# EAGLE design Arduino_plate (EAGLE 7.4.0)
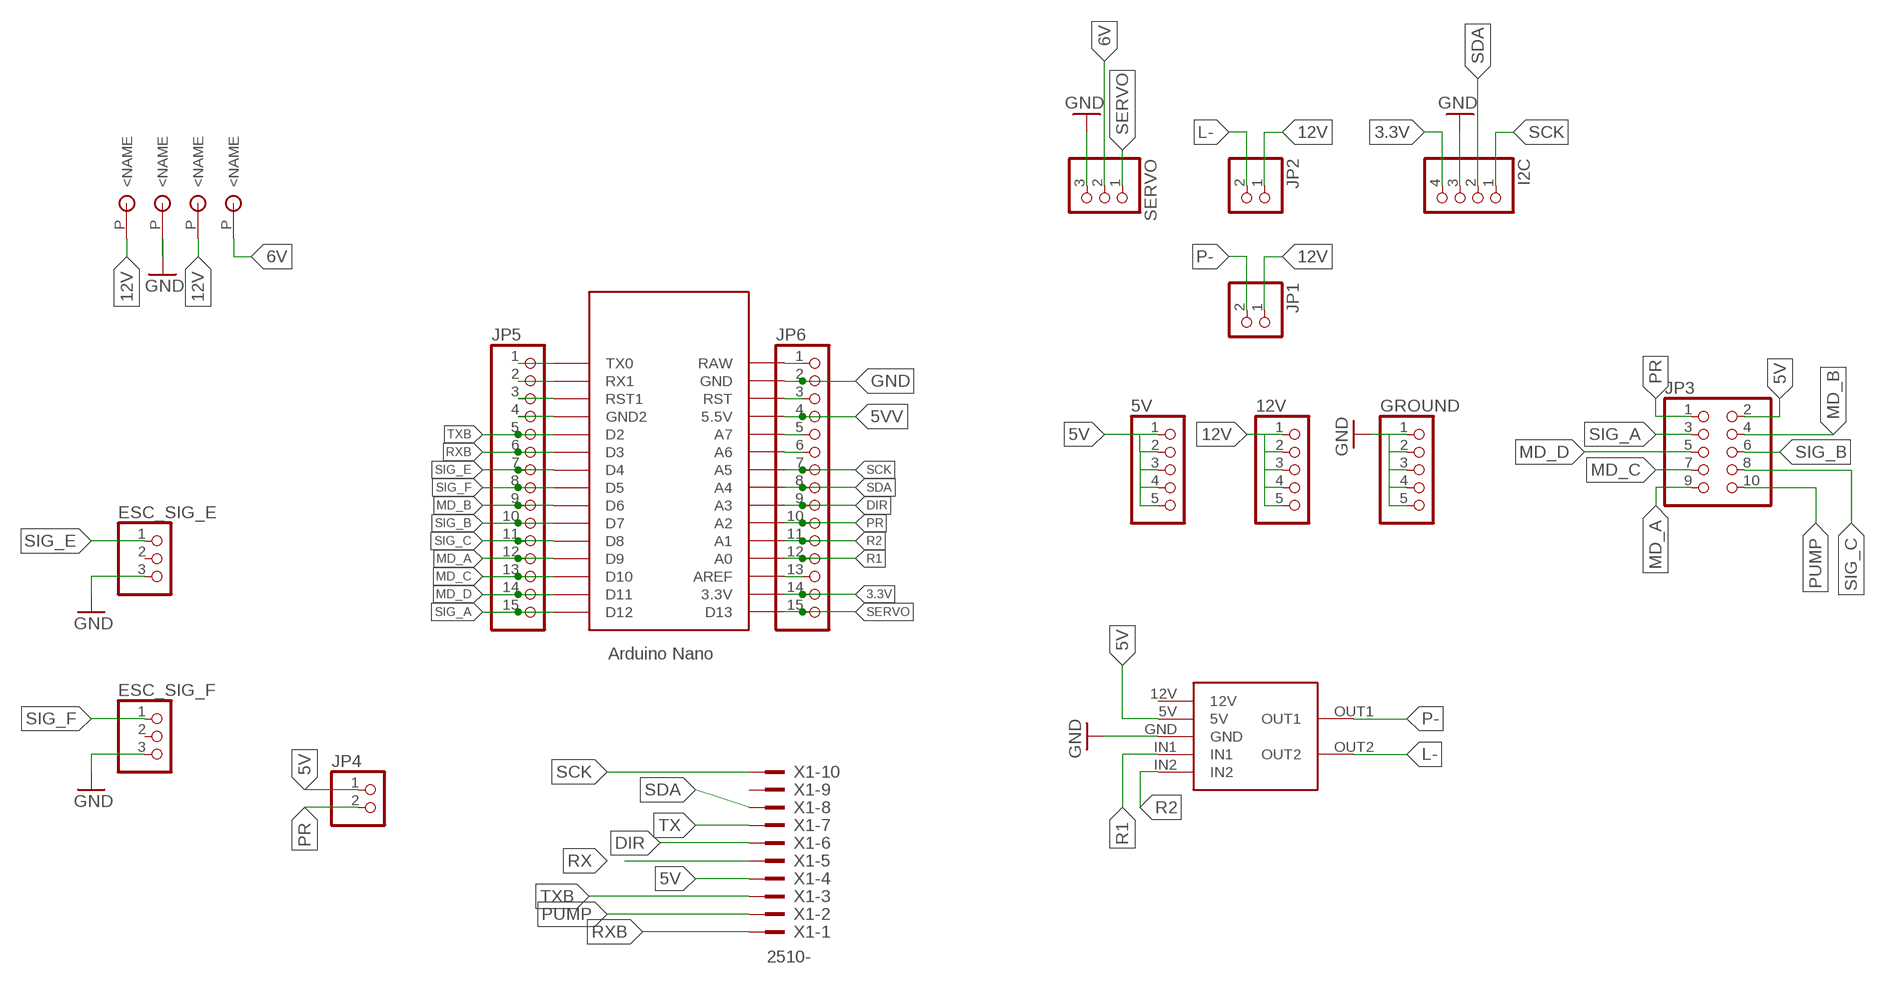
[diagram p0: schematic, sheet 1]

## Parts
5V  PINHD-1X5  [1X05]
6V  CU-SPACER  [CU-SPACER]
12  CU-SPACER  [CU-SPACER]
12V  PINHD-1X5  [1X05]
ESC_SIG_E  PINHD-1X3/90  [1X03/90]
ESC_SIG_F  PINHD-1X3/90  [1X03/90]
GND  CU-SPACER  [CU-SPACER]
GROUND  PINHD-1X5  [1X05]
I2C  PINHD-1X4/90  [1X04/90]
JP1  PINHD-1X2/90  [1X02/90]
JP2  PINHD-1X2/90  [1X02/90]
JP3  PINHD-2X5  [2X05]
JP4  PINHD-1X2/90  [1X02/90]
JP5  PINHD-1X15  [1X15]
JP6  PINHD-1X15  [1X15]
SERVO  PINHD-1X3/90  [1X03/90]
U$1  NANO  [NANO]
U$3  2-RELAY-MODULE  [2-RELAY-MODULE]
U$4  CU-SPACER  [CU-SPACER]
X1  2510-  [PAK100/2500-10]

## Nets
3.3V: I2C.4 JP6.14 U$1.3.3V
5V: 5V.1 5V.2 5V.3 5V.4 5V.5 JP3.2 JP4.1 U$3.5V X1.4
5VV: JP6.4 U$1.5V(5.5V)
6V: 6V.P(<NAME) SERVO.2
12V: 12.P(<NAME) 12V.1 12V.2 12V.3 12V.4 12V.5 JP1.1 JP2.1 U$4.P(<NAME)
DIR: JP6.9 U$1.A3 X1.6
GND: ESC_SIG_E.3 ESC_SIG_F.3 GND.P(<NAME) GROUND.1 GROUND.2 GROUND.3 GROUND.4 GROUND.5 I2C.3 JP6.2 SERVO.3 U$1.GND U$3.GND
L-: JP2.2 U$3.OUT2
MD_A: JP3.9 JP5.12 U$1.D9
MD_B: JP3.4 JP5.9 U$1.D6
MD_C: JP3.7 JP5.13 U$1.D10
MD_D: JP3.5 JP5.14 U$1.D11
N$4: JP5.3 U$1.RST1
N$5: JP5.4 U$1.GND1(GND2)
N$7: JP6.1 U$1.RAW
N$8: JP6.3 U$1.RST
N$9: JP6.5 U$1.A7
N$10: JP6.6 U$1.A6
N$17: JP6.13 U$1.AREF
P-: JP1.2 U$3.OUT1
PR: JP3.1 JP4.2 JP6.10 U$1.A2
PUMP: JP3.10 X1.2
R1: JP6.12 U$1.A0 U$3.IN1
R2: JP6.11 U$1.A1 U$3.IN2
RX: JP5.2 U$1.RX1 X1.5
RXB: JP5.6 U$1.D3 X1.1
SCK: I2C.1 JP6.7 U$1.A5 X1.10
SDA: I2C.2 JP6.8 U$1.A4 X1.8
SERVO: JP6.15 SERVO.1 U$1.D13
SIG_A: JP3.3 JP5.15 U$1.D12
SIG_B: JP3.6 JP5.10 U$1.D7
SIG_C: JP3.8 JP5.11 U$1.D8
SIG_E: ESC_SIG_E.1 JP5.7 U$1.D4
SIG_F: ESC_SIG_F.1 JP5.8 U$1.D5
TX: JP5.1 U$1.TX0 X1.7
TXB: JP5.5 U$1.D2 X1.3
Unconnected: ESC_SIG_E.2 ESC_SIG_F.2 U$1.ICSP1 U$1.ICSP2 U$1.ICSP3 U$1.ICSP4 U$1.ICSP5 U$1.ICSP6 U$3.12V X1.9

## Library data of the parts
5V 12V GROUND = pinhead:PINHD-1X5: PIN HEADER
6V 12 GND U$4 = Aquaphoton:CU-SPACER
ESC_SIG_E ESC_SIG_F SERVO = pinhead:PINHD-1X3: PIN HEADER
I2C = pinhead:PINHD-1X4: PIN HEADER
JP1 JP2 JP4 = pinhead:PINHD-1X2: PIN HEADER
JP3 = pinhead:PINHD-2X5: PIN HEADER
JP5 JP6 = pinhead:PINHD-1X15: PIN HEADER
U$1 = Arduino-clone:NANO: Arduino Nano
U$3 = Aquaphoton:2-RELAY-MODULE
X1 = con-3m:2510-: 3M (TM) Pak 100 4-Wall Header Source: 3M; MF: 3M; MPN: 2510-6002UB; OC_FARNELL: 9838244; OC_NEWARK: 46F4725

## Net classes
0 default: width 0.6 mm, drill 0.6 mm, clearance 0.6 mm
1 12V: width 1 mm, drill 0.8 mm, clearance 1 mm
2 GND: width 1 mm, drill 0.8 mm, clearance 1 mm
3 5V: width 0.8 mm, drill 0.8 mm, clearance 0.8 mm

## Board
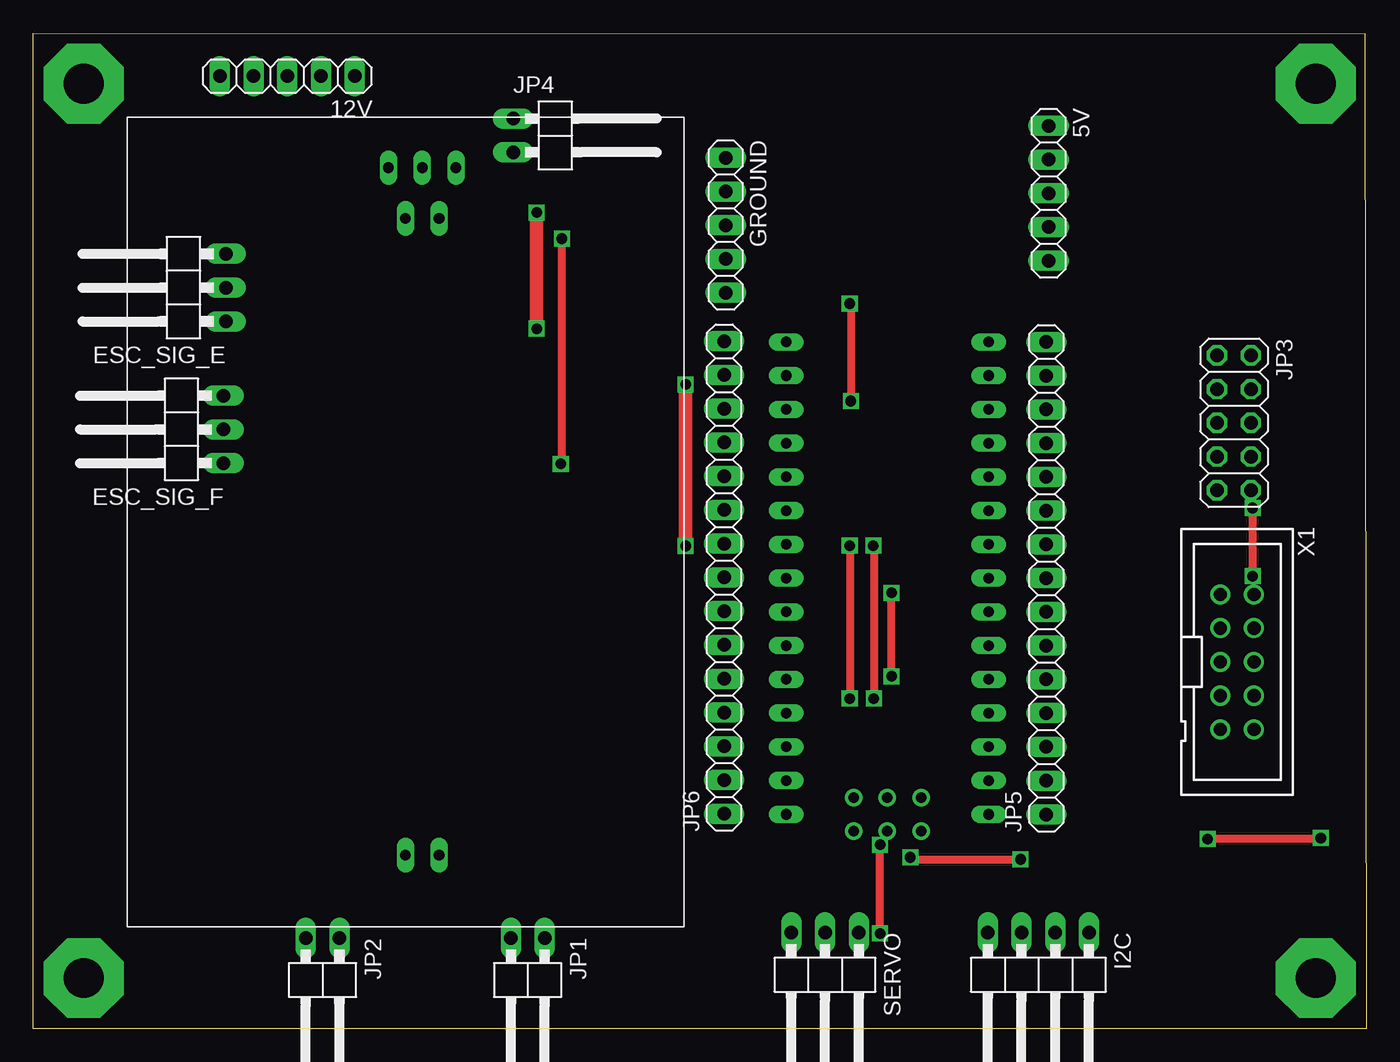
[diagram p1: board, top side]
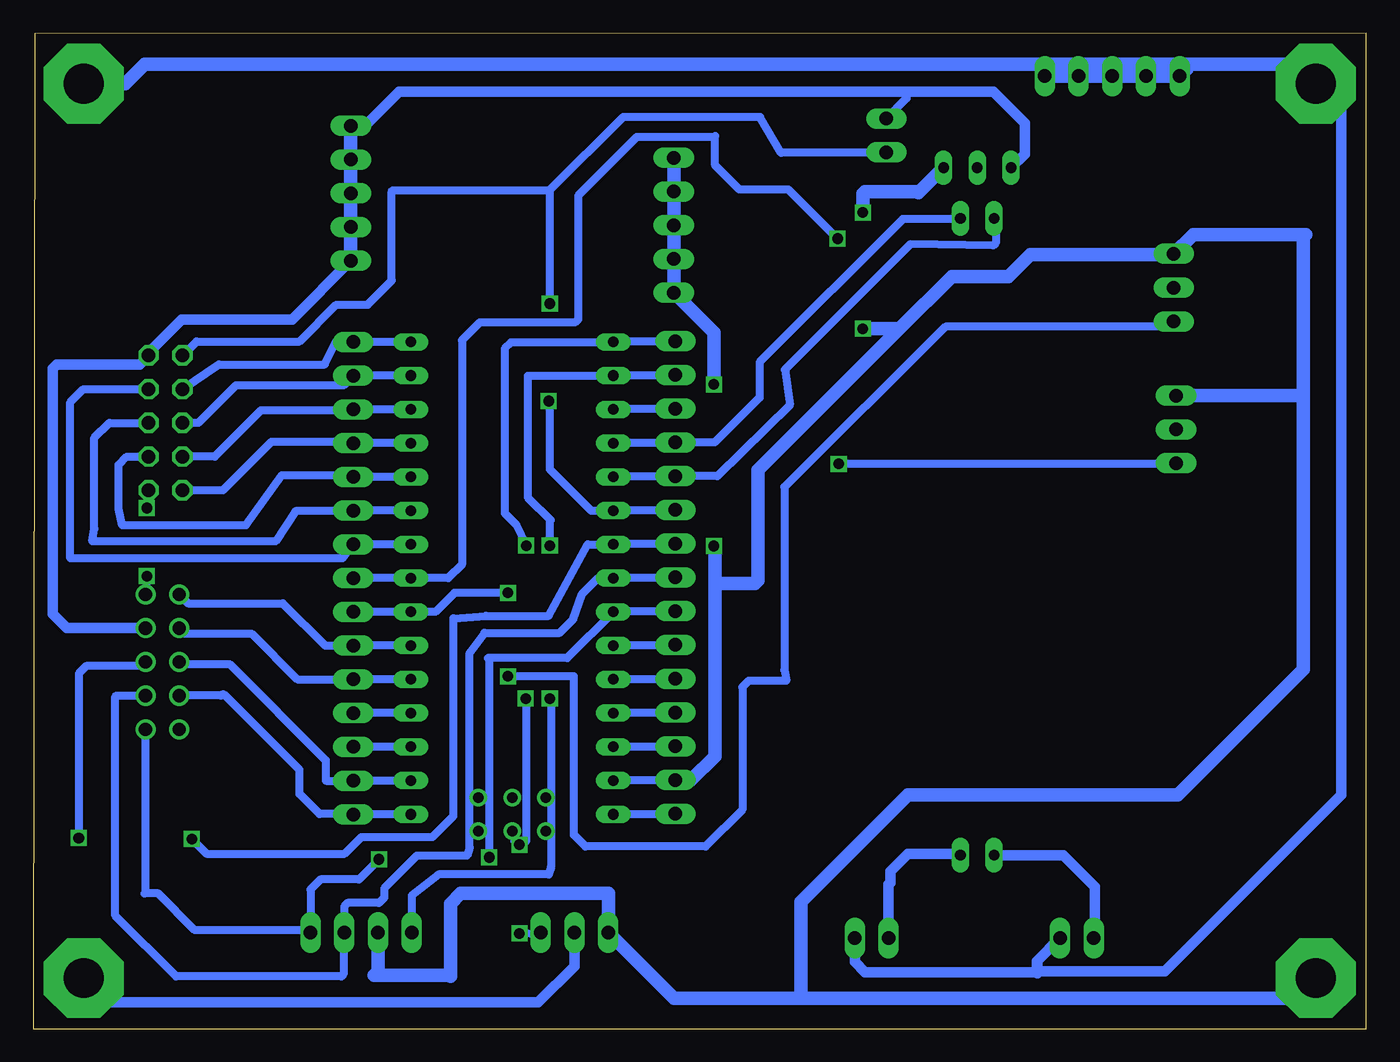
[diagram p2: board, bottom side, seen from below]

Size 100.33 x 74.93 mm. Coordinates in mm from the lower left corner, seen from the top.
Outline: 0,0 0,74.93 100.22,74.88 100.33,0 0,0
Copper layers (1*16): Top 0.035mm / dielectric 1.5mm / Bottom 0.035mm
Design rules "default *": minimum track width 0.6mm, minimum drill 0.8mm, track to track 0.8mm, track to pad 0.8mm, pad to pad 0.8mm, via to via 0.8mm, smd to smd 0.8mm, copper to edge 0.8mm, drill to drill 0.8mm, minimum pad ring 10mil, minimum via ring 8mil, stop-mask expansion 4mil, vias tented up to drill 0mil, thermal gap 10mil

### Footprints (pad centres in the part's own frame; a part is rotated, then mirrored left to right if it is on the bottom)
1X05 = drill 1.016 long: 1 -5.08,0; 2 -2.54,0; 3 0,0; 4 2.54,0; 5 5.08,0
CU-SPACER = drill 3 pad 6 octagon: P 0,0
1X03/90 = drill 1.016 long: 1 -2.54,-3.81; 2 0,-3.81; 3 2.54,-3.81
1X04/90 = drill 1.016 long: 1 -3.81,-3.81; 2 -1.27,-3.81; 3 1.27,-3.81; 4 3.81,-3.81
1X02/90 = drill 1.016 long: 1 -1.27,-3.81; 2 1.27,-3.81
2X05 = drill 1.016 octagon: 1 -5.08,-1.27; 2 -5.08,1.27; 3 -2.54,-1.27; 4 -2.54,1.27; 5 0,-1.27; 6 0,1.27; 7 2.54,-1.27; 8 2.54,1.27; 9 5.08,-1.27; 10 5.08,1.27
1X15 = drill 1.016 long: 1 -17.78,0; 2 -15.24,0; 3 -12.7,0; 4 -10.16,0; 5 -7.62,0; 6 -5.08,0; 7 -2.54,0; 8 0,0; 9 2.54,0; 10 5.08,0; 11 7.62,0; 12 10.16,0; 13 12.7,0; 14 15.24,0; 15 17.78,0
NANO = drill 0.8 long: 3.3V -10.16,24.13; 5V -10.16,-1.27; A0 -10.16,19.05; A1 -10.16,16.51; A2 -10.16,13.97; A3 -10.16,11.43; A4 -10.16,8.89; A5 -10.16,6.35; A6 -10.16,3.81; A7 -10.16,1.27; AREF -10.16,21.59; D2 5.08,1.27; D3 5.08,3.81; D4 5.08,6.35; D5 5.08,8.89; D6 5.08,11.43; D7 5.08,13.97; D8 5.08,16.51; D9 5.08,19.05; D10 5.08,21.59; D11 5.08,24.13; D12 5.08,26.67; D13 -10.16,26.67; GND -10.16,-6.35; GND1 5.08,-1.27; RAW -10.16,-8.89; RST -10.16,-3.81; RST1 5.08,-3.81; RX1 5.08,-6.35; TX0 5.08,-8.89 | drill 0.8: ICSP1 -5.08,-10.16; ICSP2 -5.08,-7.62; ICSP3 -2.54,-10.16; ICSP4 -2.54,-7.62; ICSP5 0,-10.16; ICSP6 0,-7.62
2-RELAY-MODULE = drill 0.8 long: 5V 19.685,57.15; 12V 22.225,57.15; GND 24.765,57.15; IN1 23.495,53.34; IN2 20.955,53.34; OUT1 23.495,5.397; OUT2 20.955,5.397
PAK100/2500-10 = drill 1 pad 1.422: 1 -5.08,-1.27; 2 -5.08,1.27; 3 -2.54,-1.27; 4 -2.54,1.27; 5 0,-1.27; 6 0,1.27; 7 2.54,-1.27; 8 2.54,1.27; 9 5.08,-1.27; 10 5.08,1.27

### Placement (x,y rotation side)
5V  76.43,62.87 270 top
6V  96.52,3.81 0 top
12  96.52,71.12 0 top
12V  19.12,71.7 180 top
ESC_SIG_E  10.68,55.78 90 top
ESC_SIG_F  10.51,45.11 90 top
GND  3.81,3.81 0 top
GROUND  52.11,60.47 270 top
I2C  75.65,3.43 180 top
JP1  37.22,3.02 180 top
JP2  21.77,3.02 180 top
JP3  90.37,45.6 270 top
JP4  39.93,67.23 270 top
JP5  76.25,33.91 90 top
JP6  52,33.96 90 top
SERVO  59.59,3.43 180 top
U$1  66.82,25.03 0 top
U$3  7.06,7.66 0 top
U$4  3.81,71.12 0 top
X1  90.61,27.61 270 top

### Tracks (layer width: path | path; a pad name or v marks a point on that pad's centre or on a via)
3.3V  (via drill 0.8)
  Top 0.6: v61.45,36.36 v61.45,24.84
  Bottom 0.6: JP6.14 56.61,49.2 U$1.3.3V 56.72,49.21 56.8,49.13 63.11,49.13 63.11,39.98 61.37,38.25 61.45,38.17 v61.45,36.36 | I2C.4 71.84,10.03 69.83,11.61 61.54,11.61 61.37,12.14 61.37,24.76 v61.45,24.84
5V
  Bottom 0.6: JP4.1 34.59,70.03 34.59,70.52
  Bottom 0.8: 5V.5 80.84,53.38 89.14,53.38 91.64,50.88 JP3.2 92.32,50 98.56,50 98.87,49.69 98.87,31.23 97.79,30.15 X1.4 | U$3.5V 25.71,65.84 25.71,68.15 28.08,70.52 34.59,70.52 72.79,70.52 75.35,67.95 5V.1
  Bottom 1: 5V.1 5V.2 5V.3 5V.4 5V.5
5VV
  Bottom 0.6: U$1.5V 56.72,23.7 56.72,23.53 56.44,23.8 JP6.4
6V
  Bottom 0.8: 6V.P 94.68,1.97 62.32,1.97 59.59,4.7 SERVO.2
12V
  Bottom 0.6: 12V.1 24.2,71.27
  Bottom 0.8: JP1.1 38.49,5.03 37.72,4.26 24.86,4.26 24.77,4.16 24.77,5.11 JP2.1 24.79,5.08 24.79,4.33 15.17,4.33 1.89,17.61 1.89,69.56 3.45,71.12 U$4.P
  Bottom 1: U$4.P 5.27,72.58 13.51,72.58 | 13.51,72.58 91.94,72.58 93.41,71.12 12.P | 12V.1 12V.2 12V.3 12V.4 12V.5 13.51,72.23 13.51,72.58
DIR  (via drill 0.8)
  Top 0.6: v96.9,14.35 96.83,14.28 v88.4,14.28
  Bottom 0.6: JP6.9 56.61,36.51 U$1.A3 58.59,36.45 61.53,31.07 66.25,31.07 68.7,30.88 68.7,16.01 70.28,14.43 75.63,14.43 76.89,13.17 87.29,13.17 v88.4,14.28 | X1.6 92.2,27.29 96.35,27.29 96.9,26.74 v96.9,14.35
GND  (via drill 0.8)
  Top 1: v49.1,48.49 v49.1,36.34 | v37.9,61.44 v37.9,52.68
  Bottom 0.6: U$1.GND 56.61,18.73 JP6.2
  Bottom 1: GROUND.1 GROUND.2 GROUND.3 GROUND.4 GROUND.5 49.1,52.38 v49.1,48.49 | 31.82,64.84 U$3.GND 33.7,62.93 33.77,63.01 37.74,63.01 37.9,62.86 v37.9,61.44 | v49.1,36.34 49.03,36.27 49.03,33.52 | 49.03,33.52 49.03,20.5 50.81,18.73 JP6.2 | GND.P 5.41,2.21 5.49,2.29 42.62,2.29 | 42.62,2.29 42.54,2.37 42.54,9.54 34.5,17.59 14.18,17.59 4.73,27.04 4.73,47.63 | 4.73,47.63 4.74,47.65 ESC_SIG_F.3 | 4.73,47.63 4.73,59.62 4.57,59.78 13.03,59.78 ESC_SIG_E.3 14.53,58.28 25.29,58.28 26.95,56.62 31.2,56.62 35.14,52.68 | 35.14,52.68 45.77,42.05 45.77,33.75 46.01,33.52 49.03,33.52 | 42.62,2.29 52.1,2.29 SERVO.3 57.04,10.17 68.15,10.17 68.94,9.39 68.94,3.94 69.02,4.02 74.69,4.02 74.38,4.33 I2C.3 | 35.14,52.68 v37.9,52.68
L-
  Bottom 0.8: JP2.2 20.42,6.92 20.42,10.69 22.78,13.06 U$3.OUT2
MD_A
  Bottom 0.6: U$1.D9 JP5.12 76.34,44.16 82.41,44.16 86.06,40.52 JP3.9
MD_B
  Bottom 0.6: U$1.D6 JP5.9 77.05,35.41 97.53,35.41 97.53,47.16 96.56,48.14 JP3.4
MD_C
  Bottom 0.6: U$1.D10 JP5.13 76.33,46.53 83.2,46.53 86.67,43.06 JP3.7
MD_D
  Bottom 0.6: U$1.D11 JP5.14 76.98,48.42 85.09,48.42 87.91,45.6 JP3.5
N$4
  Bottom 0.6: U$1.RST1 JP5.3
N$5
  Bottom 0.6: U$1.GND1 JP5.4
N$7
  Bottom 0.6: U$1.RAW 56.61,16.18 JP6.1
N$8
  Bottom 0.6: U$1.RST 56.61,21.27 JP6.3
N$9
  Bottom 0.6: U$1.A7 56.75,26.21 56.77,26.21 56.64,26.34 JP6.5
N$10
  Bottom 0.6: U$1.A6 56.77,28.73 56.62,28.89 JP6.6
N$17
  Bottom 0.6: U$1.AREF 56.61,46.66 JP6.13
P-
  Bottom 0.8: U$3.OUT1 30.65,13.15 34.5,13.15 35.83,11.83 35.83,10.98 35.95,10.85 JP1.2
PR  (via drill 0.8)
  Top 0.6: v61.45,54.58 61.53,54.5 v61.53,47.24
  Bottom 0.6: JP6.10 56.61,39.05 U$1.A2 58.33,38.99 61.45,42.11 61.45,47.16 v61.53,47.24 | JP4.2 36.16,65.93 44.04,65.93 45.62,68.61 49.32,68.61 55.94,68.61 61.45,63.1 | 61.45,63.1 v61.45,54.58 | JP3.1 88.04,51.74 80.28,51.74 77.52,54.5 75.16,54.5 73.35,56.31 73.35,63.01 73.26,63.1 61.45,63.1
PUMP  (via drill 0.8)
  Top 0.6: v91.78,34.07 v91.78,39.2
  Bottom 0.6: X1.2 91.78,32.78 v91.78,34.07 | v91.78,39.2 91.64,39.34 JP3.10
R1
  Bottom 0.6: U$1.A0 56.61,44.12 JP6.12 49.04,44.12 45.66,47.51 45.66,50.17 34.88,60.94 30.61,60.94 U$3.IN1
R2
  Bottom 0.6: U$1.A1 56.61,41.59 JP6.11 48.84,41.59 43.39,46.94 43.77,49.6 34.31,59.05 28.07,58.95 27.89,59.14 27.89,60.87 U$3.IN2
RX
  Bottom 0.6: U$1.RX1 JP5.2 78.29,18.67 78.31,18.69 78.31,20.2 85.56,27.45 89.18,27.45 X1.5
RXB
  Bottom 0.6: U$1.D3 JP5.6 78.35,28.83 81.54,32.02 88.67,32.02 X1.1
SCK  (via drill 0.8)
  Top 0.6: v66,12.9 66.16,12.75 v74.3,12.75
  Bottom 0.6: JP6.7 56.61,31.43 U$1.A5 60.14,27.9 66.13,27.9 66,27.9 v66,12.9 | X1.10 91.88,10.24 91.94,10.17 90.92,10.17 88.16,7.41 79.64,7.41 I2C.1 79.46,10.47 78.7,11.24 75.81,11.24 v74.3,12.75
SDA
  Bottom 0.6: JP6.8 56.61,33.97 U$1.A4 57.82,33.91 59.01,32.73 59.69,30.82 60.71,29.79 66.36,29.79 67.48,28.3 67.48,13.63 67.68,13.01 71.46,13.01 73.91,10.56 73.91,9.86 74.3,9.46 76.67,9.46 76.92,9.21 I2C.2 76.97,7.19 76.97,4.1 77.13,3.94 89.58,3.94 94.15,8.51 94.15,25 94.08,25.07 X1.8
SERVO  (via drill 0.8)
  Top 0.6: v63.74,7.16 v63.74,13.85 | v63.22,36.35 63.26,36.36 v63.26,24.84
  Bottom 0.6: JP6.15 56.61,51.74 U$1.D13 56.7,51.66 64.37,51.66 64.84,51.18 64.84,38.8 63.97,37.94 v63.22,36.35 | SERVO.1 62.27,7.1 v63.74,7.16 | v63.26,24.84 63.25,24.68 63.25,14.07 | 63.25,14.07 63.97,13.96 64.11,14.1 64.11,14.5 | v63.74,13.85 63.25,14.07
SIG_A
  Bottom 0.6: U$1.D12 JP5.15 77.57,51.69 78.39,50 86.37,50 JP3.3
SIG_B
  Bottom 0.6: U$1.D7 JP5.10 76.28,38.96 80.6,38.96 82.09,36.67 95.88,36.67 95.72,37.62 95.72,44.48 94.61,45.6 JP3.6
SIG_C
  Bottom 0.6: U$1.D8 JP5.11 76.36,41.64 81.62,41.64 84.33,37.88 93.62,37.88 93.91,39.12 93.91,42.43 93.28,43.06 JP3.8
SIG_E  (via drill 0.8)
  Top 0.6: v64.6,26.52 v64.6,32.81
  Bottom 0.6: U$1.D4 | U$1.D4 JP5.7 | ESC_SIG_E.1 14.89,52.84 31.67,52.84 43.8,40.79 43.8,26.97 43.65,26.18 46.48,26.18 46.95,25.71 46.95,16.48 49.72,13.72 58.77,13.72 59.64,14.59 59.64,26.52 v64.6,26.52 | v64.6,32.81 68.62,32.81 70.06,31.37 U$1.D4
SIG_F  (via drill 0.8)
  Top 0.6: v39.71,42.51 39.79,42.59 v39.79,59.46
  Bottom 0.6: JP5.8 U$1.D5 69.09,33.91 68.07,34.94 68.07,51.82 66.73,53.16 59.56,53.16 59.32,53.39 59.32,62.7 54.91,67.11 49.08,67.11 49,67.19 49,64.98 47.19,63.17 43.49,63.17 v39.79,59.46 | ESC_SIG_F.1 14.38,42.51 v39.71,42.51
TX
  Bottom 0.6: U$1.TX0 JP5.1 76.28,16.17 78.78,16.17 80.28,17.66 80.28,19.48 85.96,25.16 86.11,25.16 86.2,25.07 X1.7
TXB
  Bottom 0.6: U$1.D2 JP5.5 80.46,26.29 83.91,29.73 88.92,29.73 X1.3